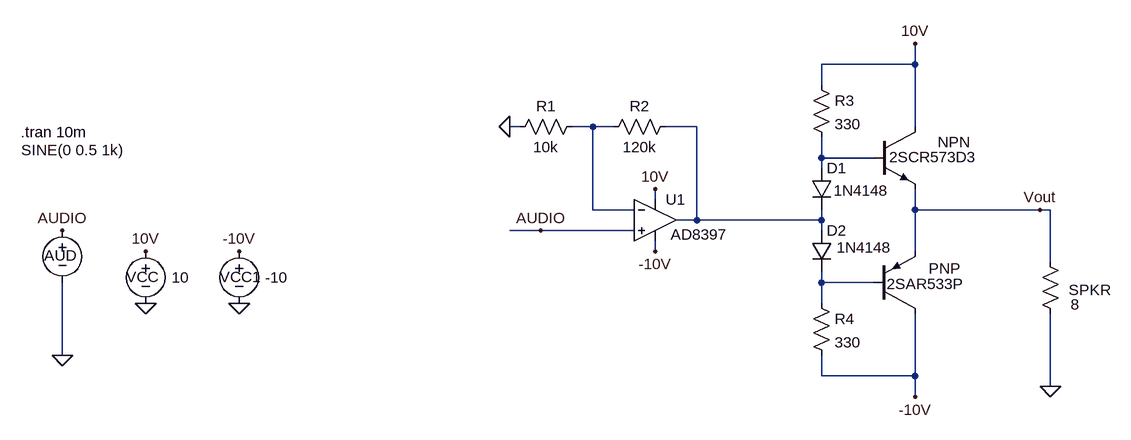
[diagram p0: schematic CLASS B Audio.asc]
CLASS B Audio.asc, the LTspice schematic file:
Version 4
SHEET 1 880 680
WIRE 208 -176 208 -208
WIRE 208 -176 64 -176
WIRE 64 -144 64 -176
WIRE -400 -80 -416 -80
WIRE -288 -80 -320 -80
WIRE -256 -80 -288 -80
WIRE -128 -80 -176 -80
WIRE 208 -80 208 -176
WIRE 64 -32 64 -64
WIRE 144 -32 64 -32
WIRE 64 -16 64 -32
WIRE -192 32 -192 16
WIRE -288 48 -288 -80
WIRE -224 48 -288 48
WIRE 208 48 208 16
WIRE 400 48 208 48
WIRE 416 48 400 48
WIRE -128 64 -128 -80
WIRE -128 64 -160 64
WIRE 64 64 64 48
WIRE 64 64 -128 64
WIRE -368 80 -416 80
WIRE -224 80 -368 80
WIRE 64 80 64 64
WIRE -192 112 -192 96
WIRE 208 112 208 48
WIRE 416 128 416 48
WIRE 64 160 64 144
WIRE 144 160 64 160
WIRE 64 192 64 160
WIRE -1104 272 -1104 160
WIRE 64 304 64 272
WIRE 208 304 208 208
WIRE 208 304 64 304
WIRE 416 320 416 208
WIRE 208 336 208 304
FLAG 208 -208 10V
FLAG 400 48 Vout
FLAG -976 112 10V
FLAG -976 192 0
FLAG -1104 272 0
FLAG -1104 80 AUDIO
FLAG -368 80 AUDIO
FLAG 416 320 0
FLAG -192 16 10V
FLAG -416 -80 0
FLAG -832 112 -10V
FLAG -832 192 0
FLAG 208 336 -10V
FLAG -192 112 -10V
SYMBOL npn 144 -80 R0
WINDOW 0 99 24 Left 2
WINDOW 3 24 47 Left 2
SYMATTR InstName NPN
SYMATTR Value 2SCR573D3
SYMBOL voltage -1104 64 R0
WINDOW 123 0 0 Left 0
WINDOW 39 0 0 Left 0
WINDOW 0 -28 54 Left 2
WINDOW 3 -63 -108 Left 2
SYMATTR InstName AUD
SYMATTR Value SINE(0 0.5 1k)
SYMBOL voltage -976 96 R0
WINDOW 0 -30 55 Left 2
WINDOW 3 40 56 Left 2
WINDOW 123 0 0 Left 0
WINDOW 39 0 0 Left 0
SYMATTR InstName VCC
SYMATTR Value 10
SYMBOL pnp 144 208 M180
WINDOW 0 85 70 Left 2
WINDOW 3 20 46 Left 2
SYMATTR InstName PNP
SYMATTR Value 2SAR533P
SYMBOL res 400 112 R0
WINDOW 0 44 59 Left 2
WINDOW 3 47 82 Left 2
SYMATTR InstName SPKR
SYMATTR Value 8
SYMBOL res -160 -96 R90
WINDOW 0 0 56 VBottom 2
WINDOW 3 32 56 VTop 2
SYMATTR InstName R2
SYMATTR Value 120k
SYMBOL res -304 -96 R90
WINDOW 0 0 56 VBottom 2
WINDOW 3 32 56 VTop 2
SYMATTR InstName R1
SYMATTR Value 10k
SYMBOL res 48 -160 R0
SYMATTR InstName R3
SYMATTR Value 330
SYMBOL res 48 176 R0
SYMATTR InstName R4
SYMATTR Value 330
SYMBOL diode 48 -16 R0
WINDOW 3 35 34 Left 2
SYMATTR InstName D1
SYMATTR Value 1N4148
SYMBOL diode 48 80 R0
WINDOW 3 39 26 Left 2
SYMATTR InstName D2
SYMATTR Value 1N4148
SYMBOL OpAmps\\AD8397 -192 0 R0
WINDOW 3 24 86 Left 2
SYMATTR InstName U1
SYMBOL voltage -832 96 R0
WINDOW 0 -30 55 Left 2
WINDOW 3 40 56 Left 2
WINDOW 123 0 0 Left 0
WINDOW 39 0 0 Left 0
SYMATTR InstName VCC1
SYMATTR Value -10
TEXT -1168 -72 Left 2 !.tran 10m

The netlist it stands for:
* CLASS B Audio.asc
Q§NPN 10V N003 Vout 0 2SCR573D3
V§AUD AUDIO 0 SINE(0 0.5 1k)
VCC 10V 0 10
Q§PNP -10V N004 Vout 0 2SAR533P
R§SPKR Vout 0 8
R2 N002 N001 120k
R1 N001 0 10k
R3 10V N003 330
R4 N004 -10V 330
D1 N003 N002 1N4148
D2 N002 N004 1N4148
XU1 AUDIO N001 10V -10V N002 AD8397  ; pins In+ In- V+ V- OUT
VCC1 -10V 0 -10
.model D D
.lib standard.dio
.model NPN NPN
.model PNP PNP
.lib standard.bjt
.tran 10m
.backanno
.end